# Altium schematic sheet Electronic Load Top.SchDoc
size 406 x 304 mm; SheetNumber: 1; SheetTotal: 14
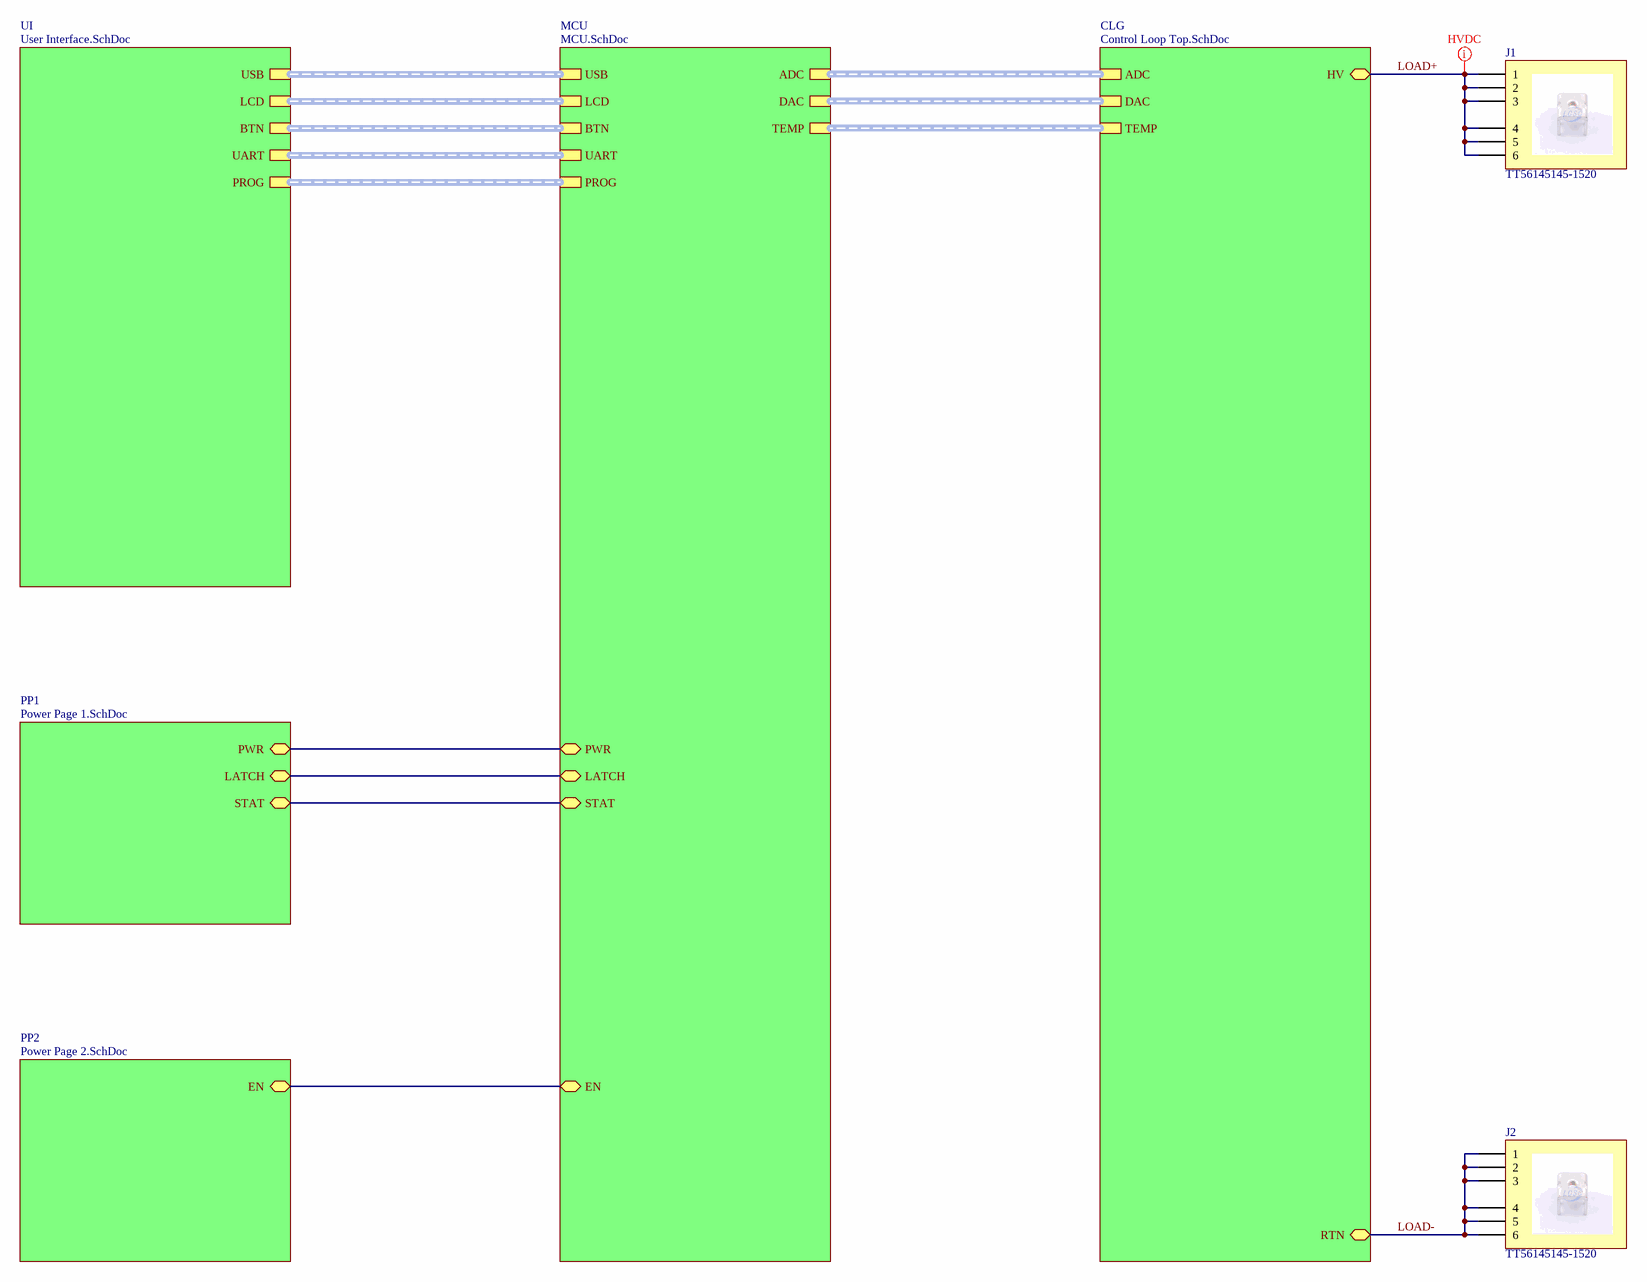
[diagram p0: Electronic Load Top.SchDoc]

## Parts
J1  TT56145145-1520  [XFCN_TT56145145-1520]
J2  TT56145145-1520  [XFCN_TT56145145-1520]

## Sub-sheets
CLG = Control Loop Top.SchDoc: HV (bidir), RTN (bidir), DAC (harness DAC), TEMP (harness TEMP), ADC (harness ADC)
MCU = MCU.SchDoc: DAC (harness DAC), TEMP (harness TEMP), ADC (harness ADC), LCD (harness LCD), USB (harness USB), BTN (harness BTN), PWR (bidir), LATCH (bidir), UART (harness UART), PROG (harness PROG), EN (bidir), STAT (bidir)
PP1 = Power Page 1.SchDoc: PWR (bidir), LATCH (bidir), STAT (bidir)
PP2 = Power Page 2.SchDoc: EN (bidir)
UI = User Interface.SchDoc: USB (harness USB), LCD (harness LCD), BTN (harness BTN), UART (harness UART), PROG (harness PROG)

## Nets
LOAD+: J1.1 J1.2 J1.3 J1.4 J1.5 J1.6 ; sheet CLG/HV
LOAD-: J2.1 J2.2 J2.3 J2.4 J2.5 J2.6 ; sheet CLG/RTN
(unnamed): sheet MCU/PWR, sheet PP1/PWR
(unnamed): sheet MCU/LATCH, sheet PP1/LATCH
(unnamed): sheet MCU/EN, sheet PP2/EN
(unnamed): sheet MCU/STAT, sheet PP1/STAT

## Buses and harness runs
harness sheet CLG/ADC = sheet MCU/ADC
harness sheet CLG/DAC = sheet MCU/DAC
harness sheet CLG/TEMP = sheet MCU/TEMP
harness sheet MCU/BTN = sheet UI/BTN
harness sheet MCU/LCD = sheet UI/LCD
harness sheet MCU/PROG = sheet UI/PROG
harness sheet MCU/UART = sheet UI/UART
harness sheet MCU/USB = sheet UI/USB

## Layout directives
net class HVDC: LOAD+

## Notes on the sheet
- Rev
- Sheet Name:
- Date:
- Sheet
- Designer:
- of

## Library data of the parts
J1 J2 = Term,Screw,M5,Top,Thru: 6 M5 Through Hole Screw Connectors ROHS; Manufacturer 1: XFCN; Vendor 1 Part Number: C19724595; Vendor 1: LCSC; Part Name: Term,Screw,M5,Top,Thru; CreatedBy: Judd Foster; HelpURL: https://www.lcsc.com/datasheet/C19724595.pdf; Manufacturer 1 Part Number: TT56145145-1520